# EAGLE board Spartan6dev (EAGLE 5.06), part 1 of 2
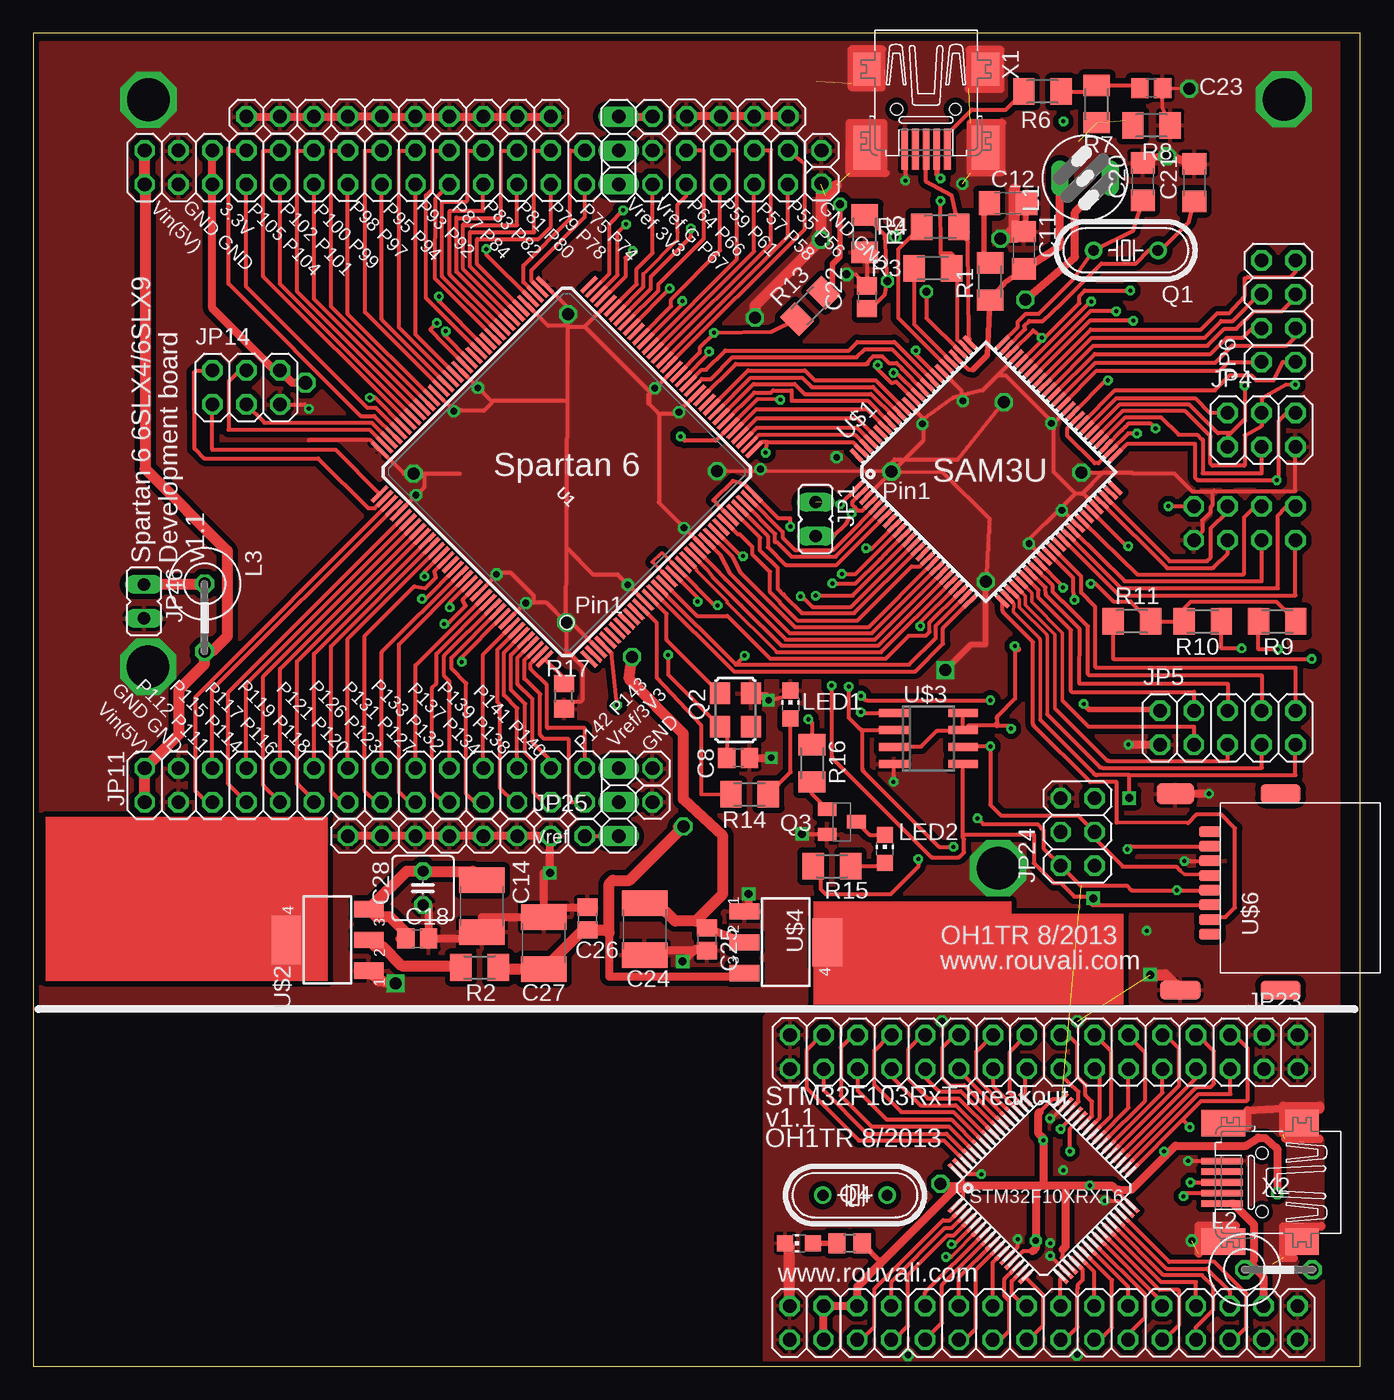
[diagram p3: board, top side]
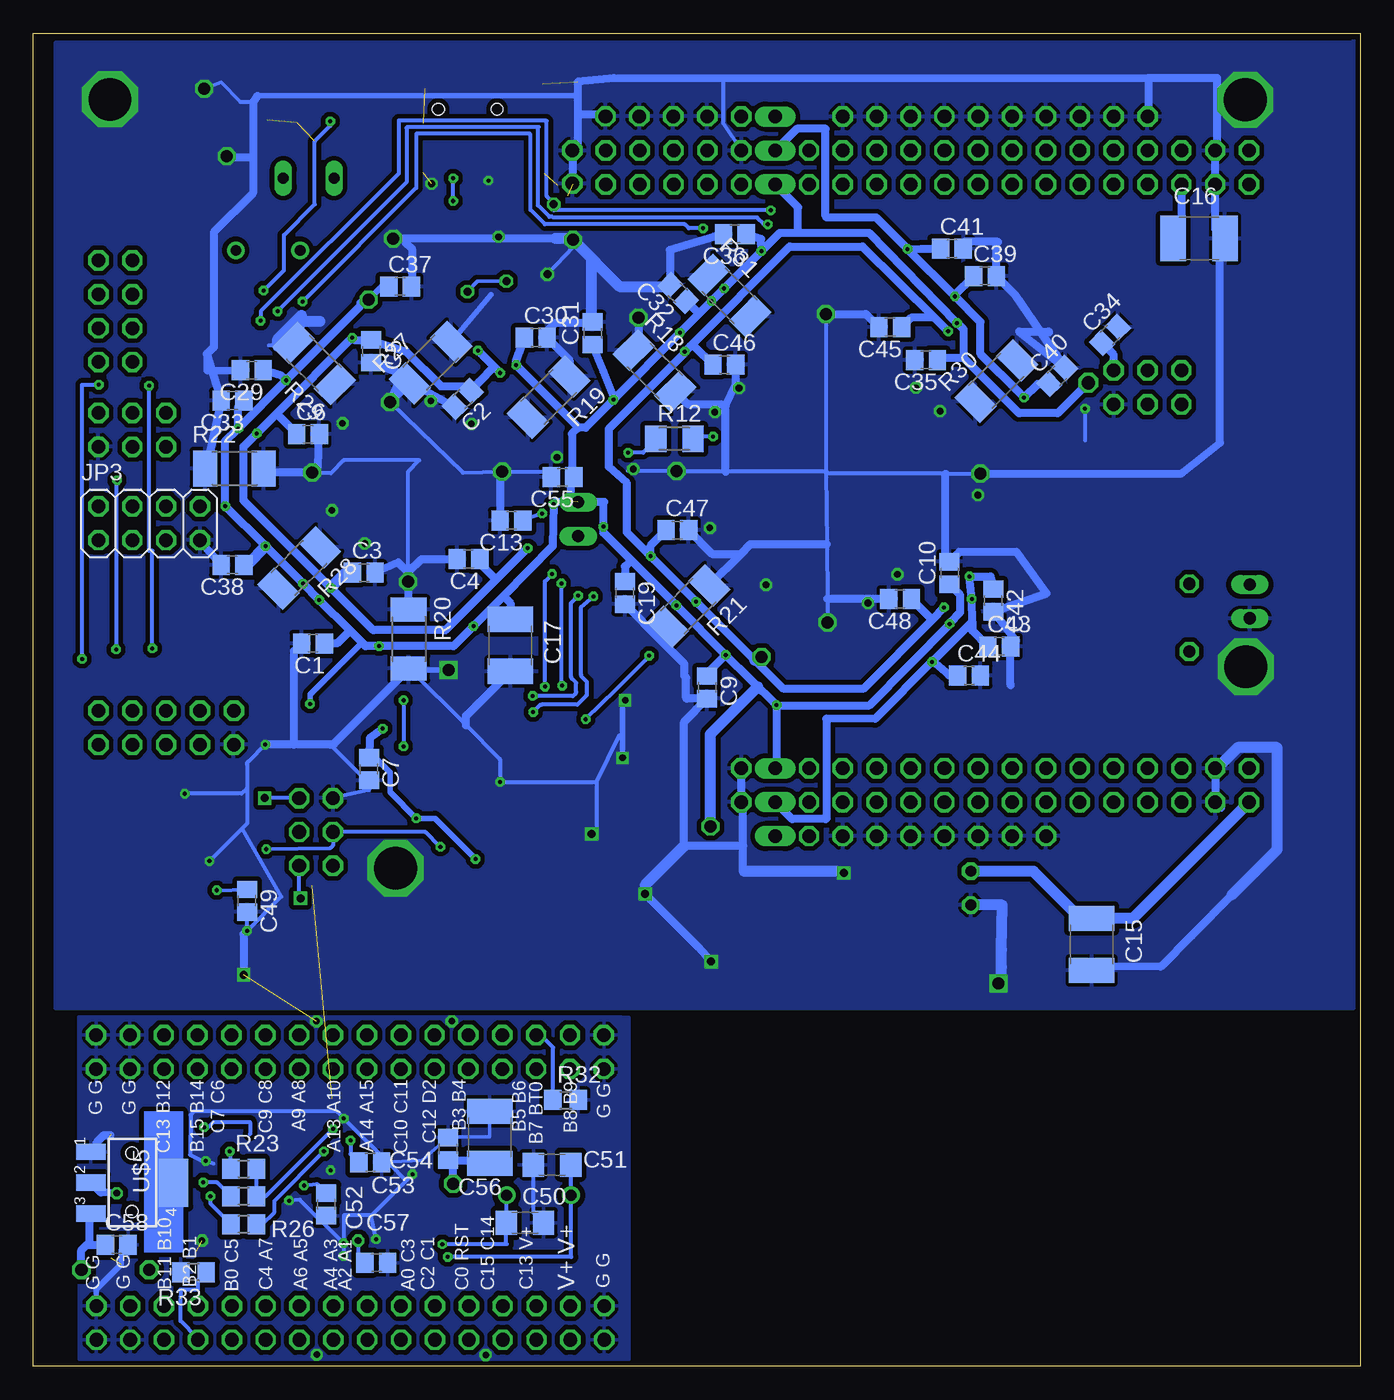
[diagram p4: board, bottom side, seen from below]

Size 99.57 x 100 mm. Coordinates in mm from the lower left corner, seen from the top.
Outline: 0,0 99.57,0 99.57,100 0,100 0,0
Copper layers (1*16): Top 0.035mm / dielectric 1.5mm / Bottom 0.035mm
Design rules "ITEADstudio_DRC *": minimum track width 6mil, minimum drill 12mil, track to track 6mil, track to pad 6mil, pad to pad 6mil, via to via 6mil, smd to smd 0mil, copper to edge 10mil, drill to drill 10mil, minimum pad ring 10mil, minimum via ring 8mil, stop-mask expansion 2mil, vias tented up to drill 100mil, thermal gap 10mil

## Footprints (pad centres in the part's own frame; a part is rotated, then mirrored left to right if it is on the bottom)
C0805 = smd 1.3 x 1.5: 1 -0.85,0; 2 0.85,0
C1206 = smd 1.6 x 1.8: 1 -1.4,0; 2 1.4,0
C1812 = smd 1.9 x 3.4: 1 -1.95,0; 2 1.95,0
C025-050X050 = drill 0.813 octagon: 1 -1.27,0; 2 1.27,0
JP1 = drill 0.914 long: 1 0,-1.27; 2 0,1.27
2X12 = drill 1.016 octagon: 1 -13.97,-1.27; 2 -13.97,1.27; 3 -11.43,-1.27; 4 -11.43,1.27; 5 -8.89,-1.27; 6 -8.89,1.27; 7 -6.35,-1.27; 8 -6.35,1.27; 9 -3.81,-1.27; 10 -3.81,1.27; 11 -1.27,-1.27; 12 -1.27,1.27; 13 1.27,-1.27; 14 1.27,1.27; 15 3.81,-1.27; 16 3.81,1.27; 17 6.35,-1.27; 18 6.35,1.27; 19 8.89,-1.27; 20 8.89,1.27; 21 11.43,-1.27; 22 11.43,1.27; 23 13.97,-1.27; 24 13.97,1.27
2X04 = drill 1.016 octagon: 1 -3.81,-1.27; 2 -3.81,1.27; 3 -1.27,-1.27; 4 -1.27,1.27; 5 1.27,-1.27; 6 1.27,1.27; 7 3.81,-1.27; 8 3.81,1.27
2X03 = drill 1.016 octagon: 1 -2.54,-1.27; 2 -2.54,1.27; 3 0,-1.27; 4 0,1.27; 5 2.54,-1.27; 6 2.54,1.27
2X05 = drill 1.016 octagon: 1 -5.08,-1.27; 2 -5.08,1.27; 3 -2.54,-1.27; 4 -2.54,1.27; 5 0,-1.27; 6 0,1.27; 7 2.54,-1.27; 8 2.54,1.27; 9 5.08,-1.27; 10 5.08,1.27
1X03 = drill 1.016 long: 1 -2.54,0; 2 0,0; 3 2.54,0
1X01 = drill 1.016 octagon: 1 0,0
2X14 = drill 1.016 octagon: 1 -16.51,-1.27; 2 -16.51,1.27; 3 -13.97,-1.27; 4 -13.97,1.27; 5 -11.43,-1.27; 6 -11.43,1.27; 7 -8.89,-1.27; 8 -8.89,1.27; 9 -6.35,-1.27; 10 -6.35,1.27; 11 -3.81,-1.27; 12 -3.81,1.27; 13 -1.27,-1.27; 14 -1.27,1.27; 15 1.27,-1.27; 16 1.27,1.27; 17 3.81,-1.27; 18 3.81,1.27; 19 6.35,-1.27; 20 6.35,1.27; 21 8.89,-1.27; 22 8.89,1.27; 23 11.43,-1.27; 24 11.43,1.27; 25 13.97,-1.27; 26 13.97,1.27; 27 16.51,-1.27; 28 16.51,1.27
2X02 = drill 1.016 octagon: 1 -1.27,-1.27; 2 -1.27,1.27; 3 1.27,-1.27; 4 1.27,1.27
82114R = drill 0.813 long: 1 0,1.905; 2 0,-1.905
LBC-SE = drill 0.914 octagon: 1 -2.54,0; 2 2.54,0
CHIP-LED0805 = smd 1.2 x 1.2: A 0,-1.05; C 0,1.05
HC49/S = drill 0.813 round: 1 -2.413,0; 2 2.413,0
ASF = smd 1.6 x 1.5: 1 -1.25,-1.15; 2 1.25,-1.15; 3 1.25,1.15; 4 -1.25,1.15
SOT23-BEC = smd 1 x 1.4: B -0.95,-1.1; C 0,1.1; E 0.95,-1.1
M1206 = smd 1.6 x 2: 1 -1.4,0; 2 1.4,0
R0805 = smd 1.3 x 1.5: 1 -0.95,0; 2 0.95,0
R5025 = smd 1.8 x 2.7: 1 -2.2,0; 2 2.2,0
TQ144 = smd 1.6 x 0.3: 1 -11.1,8.75; 2 -11.1,8.25; 3 -11.1,7.75; 4 -11.1,7.25; 5 -11.1,6.75; 6 -11.1,6.25; 7 -11.1,5.75; 8 -11.1,5.25; 9 -11.1,4.75; 10 -11.1,4.25; 11 -11.1,3.75; 12 -11.1,3.25; 13 -11.1,2.75; 14 -11.1,2.25; 15 -11.1,1.75; 16 -11.1,1.25; 17 -11.1,0.75; 18 -11.1,0.25; 19 -11.1,-0.25; 20 -11.1,-0.75; 21 -11.1,-1.25; 22 -11.1,-1.75; 23 -11.1,-2.25; 24 -11.1,-2.75; 25 -11.1,-3.25; 26 -11.1,-3.75; 27 -11.1,-4.25; 28 -11.1,-4.75; 29 -11.1,-5.25; 30 -11.1,-5.75; 31 -11.1,-6.25; 32 -11.1,-6.75; 33 -11.1,-7.25; 34 -11.1,-7.75; 35 -11.1,-8.25; 36 -11.1,-8.75; 73 11.1,-8.75; 74 11.1,-8.25; 75 11.1,-7.75; 76 11.1,-7.25; 77 11.1,-6.75; 78 11.1,-6.25; 79 11.1,-5.75; 80 11.1,-5.25; 81 11.1,-4.75; 82 11.1,-4.25; 83 11.1,-3.75; 84 11.1,-3.25; 85 11.1,-2.75; 86 11.1,-2.25; 87 11.1,-1.75; 88 11.1,-1.25; 89 11.1,-0.75; 90 11.1,-0.25; 91 11.1,0.25; 92 11.1,0.75; 93 11.1,1.25; 94 11.1,1.75; 95 11.1,2.25; 96 11.1,2.75; 97 11.1,3.25; 98 11.1,3.75; 99 11.1,4.25; 100 11.1,4.75; 101 11.1,5.25; 102 11.1,5.75; 103 11.1,6.25; 104 11.1,6.75; 105 11.1,7.25; 106 11.1,7.75; 107 11.1,8.25; 108 11.1,8.75 | smd 0.3 x 1.6: 37 -8.75,-11.1; 38 -8.25,-11.1; 39 -7.75,-11.1; 40 -7.25,-11.1; 41 -6.75,-11.1; 42 -6.25,-11.1; 43 -5.75,-11.1; 44 -5.25,-11.1; 45 -4.75,-11.1; 46 -4.25,-11.1; 47 -3.75,-11.1; 48 -3.25,-11.1; 49 -2.75,-11.1; 50 -2.25,-11.1; 51 -1.75,-11.1; 52 -1.25,-11.1; 53 -0.75,-11.1; 54 -0.25,-11.1; 55 0.25,-11.1; 56 0.75,-11.1; 57 1.25,-11.1; 58 1.75,-11.1; 59 2.25,-11.1; 60 2.75,-11.1; 61 3.25,-11.1; 62 3.75,-11.1; 63 4.25,-11.1; 64 4.75,-11.1; 65 5.25,-11.1; 66 5.75,-11.1; 67 6.25,-11.1; 68 6.75,-11.1; 69 7.25,-11.1; 70 7.75,-11.1; 71 8.25,-11.1; 72 8.75,-11.1; 109 8.75,11.1; 110 8.25,11.1; 111 7.75,11.1; 112 7.25,11.1; 113 6.75,11.1; 114 6.25,11.1; 115 5.75,11.1; 116 5.25,11.1; 117 4.75,11.1; 118 4.25,11.1; 119 3.75,11.1; 120 3.25,11.1; 121 2.75,11.1; 122 2.25,11.1; 123 1.75,11.1; 124 1.25,11.1; 125 0.75,11.1; 126 0.25,11.1; 127 -0.25,11.1; 128 -0.75,11.1; 129 -1.25,11.1; 130 -1.75,11.1; 131 -2.25,11.1; 132 -2.75,11.1; 133 -3.25,11.1; 134 -3.75,11.1; 135 -4.25,11.1; 136 -4.75,11.1; 137 -5.25,11.1; 138 -5.75,11.1; 139 -6.25,11.1; 140 -6.75,11.1; 141 -7.25,11.1; 142 -7.75,11.1; 143 -8.25,11.1; 144 -8.75,11.1
TQFP64 = smd 1.2 x 0.3: 1 -5.7,3.75; 2 -5.7,3.25; 3 -5.7,2.75; 4 -5.7,2.25; 5 -5.7,1.75; 6 -5.7,1.25; 7 -5.7,0.75; 8 -5.7,0.25; 9 -5.7,-0.25; 10 -5.7,-0.75; 11 -5.7,-1.25; 12 -5.7,-1.75; 13 -5.7,-2.25; 14 -5.7,-2.75; 15 -5.7,-3.25; 16 -5.7,-3.75; 33 5.7,-3.75; 34 5.7,-3.25; 35 5.7,-2.75; 36 5.7,-2.25; 37 5.7,-1.75; 38 5.7,-1.25; 39 5.7,-0.75; 40 5.7,-0.25; 41 5.7,0.25; 42 5.7,0.75; 43 5.7,1.25; 44 5.7,1.75; 45 5.7,2.25; 46 5.7,2.75; 47 5.7,3.25; 48 5.7,3.75 | smd 0.3 x 1.2: 17 -3.75,-5.7; 18 -3.25,-5.7; 19 -2.75,-5.7; 20 -2.25,-5.7; 21 -1.75,-5.7; 22 -1.25,-5.7; 23 -0.75,-5.7; 24 -0.25,-5.7; 25 0.25,-5.7; 26 0.75,-5.7; 27 1.25,-5.7; 28 1.75,-5.7; 29 2.25,-5.7; 30 2.75,-5.7; 31 3.25,-5.7; 32 3.75,-5.7; 49 3.75,5.7; 50 3.25,5.7; 51 2.75,5.7; 52 2.25,5.7; 53 1.75,5.7; 54 1.25,5.7; 55 0.75,5.7; 56 0.25,5.7; 57 -0.25,5.7; 58 -0.75,5.7; 59 -1.25,5.7; 60 -1.75,5.7; 61 -2.25,5.7; 62 -2.75,5.7; 63 -3.25,5.7; 64 -3.75,5.7
LQFP100 = smd 1.2 x 0.32: 1 -7.75,4.73; 2 -7.75,4.23; 3 -7.75,3.73; 4 -7.75,3.23; 5 -7.75,2.73; 6 -7.75,2.23; 7 -7.75,1.73; 8 -7.75,1.23; 9 -7.75,0.73; 10 -7.75,0.23; 11 -7.75,-0.27; 12 -7.75,-0.77; 13 -7.75,-1.27; 14 -7.75,-1.77; 15 -7.75,-2.27; 16 -7.75,-2.77; 17 -7.75,-3.27; 18 -7.75,-3.77; 19 -7.75,-4.27; 20 -7.75,-4.77; 21 -7.75,-5.27; 22 -7.75,-5.77; 23 -7.75,-6.27; 24 -7.75,-6.77; 25 -7.75,-7.27; 51 7.75,-7.27; 52 7.75,-6.77; 53 7.75,-6.27; 54 7.75,-5.77; 55 7.75,-5.27; 56 7.75,-4.77; 57 7.75,-4.27; 58 7.75,-3.77; 59 7.75,-3.27; 60 7.75,-2.77; 61 7.75,-2.27; 62 7.75,-1.77; 63 7.75,-1.27; 64 7.75,-0.77; 65 7.75,-0.27; 66 7.75,0.23; 67 7.75,0.73; 68 7.75,1.23; 69 7.75,1.73; 70 7.75,2.23; 71 7.75,2.73; 72 7.75,3.23; 73 7.75,3.73; 74 7.75,4.23; 75 7.75,4.73 | smd 0.32 x 1.2: 26 -6,-9.02; 27 -5.5,-9.02; 28 -5,-9.02; 29 -4.5,-9.02; 30 -4,-9.02; 31 -3.5,-9.02; 32 -3,-9.02; 33 -2.5,-9.02; 34 -2,-9.02; 35 -1.5,-9.02; 36 -1,-9.02; 37 -0.5,-9.02; 38 0,-9.02; 39 0.5,-9.02; 40 1,-9.02; 41 1.5,-9.02; 42 2,-9.02; 43 2.5,-9.02; 44 3,-9.02; 45 3.5,-9.02; 46 4,-9.02; 47 4.5,-9.02; 48 5,-9.02; 49 5.5,-9.02; 50 6,-9.02; 76 6,6.48; 77 5.5,6.48; 78 5,6.48; 79 4.5,6.48; 80 4,6.48; 81 3.5,6.48; 82 3,6.48; 83 2.5,6.48; 84 2,6.48; 85 1.5,6.48; 86 1,6.48; 87 0.5,6.48; 88 0,6.48; 89 -0.5,6.48; 90 -1,6.48; 91 -1.5,6.48; 92 -2,6.48; 93 -2.5,6.48; 94 -3,6.48; 95 -3.5,6.48; 96 -4,6.48; 97 -4.5,6.48; 98 -5,6.48; 99 -5.5,6.48; 100 -6,6.48
SOT223 = smd 1.219 x 2.235: 1 -2.311,-3.099; 2 0,-3.099; 3 2.311,-3.099 | smd 3.6 x 2.2: 4 0,3.099
SOIC8 = smd 0.6 x 2.2: 1 -1.905,-2.6; 2 -0.635,-2.6; 3 0.635,-2.6; 4 1.905,-2.6; 5 1.905,2.6; 6 0.635,2.6; 7 -0.635,2.6; 8 -1.905,2.6
MICROSDPAK = smd 0.8 x 1.6: 1 -2.03,9.47; 2 -0.93,9.47; 3 0.17,9.47; 4 1.27,9.47; 5 2.37,9.47; 6 3.47,9.47; 7 4.57,9.47; 8 5.67,9.47 | smd 1.55 x 2.8: 9 8.497,12.05 | smd 1.4 x 3: 10 -6.22,11.68; 11 -6.22,4.162; 12 8.512,4.162
32005-201 = smd 3.1 x 0.5: 1 3,1.6; 2 3,0.8; 3 3,0; 4 3,-0.8; 5 3,-1.6 | smd 2.5 x 2: M1 -3,-4.45; M2 -3,4.45 | smd 3.3 x 2: M3 2.9,4.45; M4 2.9,-4.45 | hole 0.9: 0,2.2; 0,-2.2

## Placement (x,y rotation side)
C1  [C0805]  78.59,54.23 180 bottom
C2  [C0805]  67.36,72.57 225 bottom
C3  [C0805]  74.78,59.54 0 bottom
C4  [C0805]  66.93,60.55 180 bottom
C5  [C0805]  74.22,76.15 270 bottom
C6  [C0805]  78.97,69.93 0 bottom
C7  [C0805]  74.4,44.81 270 bottom
C8  [C0805]  52.88,45.64 0 top
C9  [C0805]  49.02,50.93 270 bottom
C10  [C0805]  30.84,59.51 90 bottom
C11  [C1206]  74.32,83.72 90 top
C12  [C1206]  73.13,87.27 0 top
C13  [C0805]  63.7,63.45 180 bottom
C14  [C1812]  33.66,34.52 270 top
C15  [C1812]  20.17,31.65 270 bottom
C16  [C1812]  12.12,84.61 0 bottom
C17  [C1812]  63.78,54.08 270 bottom
C18  [C0805]  28.8,32.08 0 top
C19  [C0805]  55.19,58.01 270 bottom
C20  [C1206]  83.24,88.87 90 top
C21  [C1206]  87.1,88.8 90 top
C22  [C0805]  62.56,80.19 90 top
C23  [C0805]  83.87,95.89 0 top
C24  [C1812]  45.87,32.79 270 top
C25  [C0805]  50.55,32.03 270 top
C26  [C0805]  41.58,33.58 90 top
C27  [C1812]  38.3,31.75 90 top
C28  [C025-050X050]  29.24,35.86 270 top
C29  [C0805]  83.19,74.73 180 bottom
C30  [C0805]  61.87,77.17 0 bottom
C31  [C0805]  57.61,77.5 90 bottom
C32  [C0805]  51.21,80.52 135 bottom
C33  [C0805]  84.63,72.44 180 bottom
C34  [C0805]  18.8,77.37 45 bottom
C35  [C0805]  32.59,75.49 180 bottom
C36  [C0805]  46.94,84.94 180 bottom
C37  [C0805]  72.06,81 0 bottom
C38  [C0805]  84.63,60.12 180 bottom
C39  [C0805]  28.17,81.79 0 bottom
C40  [C0805]  22.76,74.3 45 bottom
C41  [C0805]  30.66,83.85 0 bottom
C42  [C0805]  27.56,57.45 270 bottom
C43  [C0805]  27.1,54 0 bottom
C44  [C0805]  29.36,51.82 0 bottom
C45  [C0805]  35.28,77.95 180 bottom
C46  [C0805]  47.73,75.13 0 bottom
C47  [C0805]  51.26,62.71 0 bottom
C48  [C0805]  34.54,57.56 180 bottom
C49  [C0805]  83.54,34.92 270 bottom
C50  [C1206]  62.69,10.77 0 bottom
C51  [C1206]  60.66,15.11 180 bottom
C52  [C0805]  77.6,12.14 270 bottom
C53  [C0805]  74.3,15.29 0 bottom
C54  [C0805]  68.45,16.31 90 bottom
C55  [C0805]  59.87,66.7 180 bottom
C56  [C1812]  65.33,17.17 90 bottom
C57  [C0805]  73.84,7.77 0 bottom
C58  [C0805]  93.32,9.12 0 bottom
JP1  [JP1]  58.7,63.55 180 top
JP2  [2X12]  75.79,3.25 0 top
JP3  [2X04]  90.88,63.25 0 bottom
JP4  [2X03]  92.15,70.26 0 top
JP5  [2X05]  89.61,47.9 0 top
JP6  [2X04]  93.42,79.15 90 top
JP7  [2X05]  51.54,89.94 0 top
JP8  [1X03]  43.92,91.21 90 top
JP9  [1X01]  46.46,93.75 0 top
JP10  [2X14]  24.87,89.94 0 top
JP11  [2X14]  24.87,43.59 0 top
JP12  [1X03]  43.92,42.32 270 top
JP13  [1X01]  41.38,39.78 0 top
JP14  [2X03]  15.98,73.43 0 top
JP15  [1X01]  59.13,91.21 0 top
JP16  [1X01]  59.13,88.72 0 top
JP17  [1X01]  46.46,42.32 0 top
JP18  [1X01]  46.46,44.86 0 top
JP19  [2X12]  75.82,23.57 0 top
JP20  [2X02]  58.04,23.57 180 top
JP21  [2X02]  58.01,3.25 0 top
JP22  [2X02]  93.57,3.25 0 top
JP23  [2X02]  93.6,23.57 0 top
JP24  [2X03]  78.36,40.08 90 top
JP25  [1X01]  38.84,39.78 0 top
JP26  [1X01]  31.22,39.78 0 top
JP27  [1X01]  26.14,39.78 0 top
JP28  [1X01]  36.3,39.78 0 top
JP29  [1X01]  33.76,39.78 0 top
JP30  [1X01]  28.68,39.78 0 top
JP31  [1X01]  23.6,39.78 0 top
JP32  [1X01]  56.64,93.78 0 top
JP33  [1X01]  54.1,93.78 0 top
JP34  [1X01]  51.56,93.78 0 top
JP35  [1X01]  49.02,93.78 0 top
JP36  [1X01]  38.84,93.75 0 top
JP37  [1X01]  36.3,93.75 0 top
JP38  [1X01]  33.76,93.75 0 top
JP39  [1X01]  31.22,93.75 0 top
JP40  [1X01]  28.68,93.75 0 top
JP41  [1X01]  26.14,93.75 0 top
JP42  [1X01]  23.6,93.78 0 top
JP43  [1X01]  21.06,93.75 0 top
JP44  [1X01]  18.52,93.75 0 top
JP45  [1X01]  15.98,93.75 0 top
JP46  [JP1]  8.31,57.38 180 top
L1  82114R  [82114R]  78.92,89.13 90 top
L2  LBC-SE  [LBC-SE]  93.42,7.24 0 top
L3  LBC-SE  [LBC-SE]  12.85,56.16 270 top
LED1  [CHIP-LED0805]  56.82,49.66 0 top
LED2  [CHIP-LED0805]  63.88,38.81 0 top
LED3  [CHIP-LED0805]  57.45,9.22 90 top
Q1  [HC49/S]  81.97,83.72 180 top
Q2  ASF1  [ASF]  52.68,49.23 90 top
Q3  BC817-16LT1SMD  [SOT23-BEC]  60.66,40.84 270 top
Q4  [HC49/S]  61.65,12.83 0 top
R1  [M1206]  71.78,81.38 270 top
R2  [M1206]  33.48,29.92 180 top
R3  [M1206]  67.49,82.37 0 top
R4  [M1206]  68.05,85.47 0 top
R5  [M1206]  62.38,84.96 270 top
R6  [M1206]  75.72,95.63 0 top
R7  [M1206]  79.78,94.69 270 top
R8  [M1206]  83.9,93.09 0 top
R9  [M1206]  93.32,55.88 180 top
R10  [M1206]  87.73,55.88 180 top
R11  [M1206]  82.42,55.88 0 top
R12  4.7k  [M1206]  51.49,69.57 0 bottom
R13  330  [M1206]  58.29,79.55 225 top
R14  160  [M1206]  53.75,42.9 180 top
R15  160  [M1206]  59.92,37.52 180 top
R16  160  [M1206]  58.42,45.24 90 top
R17  [R0805]  39.8,50.27 90 top
R18  [R5025]  52.96,74.68 315 bottom
R19  [R5025]  60.91,72.72 225 bottom
R20  [R5025]  71.4,54.56 270 bottom
R21  [R5025]  50.42,57.02 225 bottom
R22  [R5025]  84.48,67.36 0 bottom
R23  [R0805]  83.79,14.81 0 bottom
R24  [R0805]  61.24,9.22 180 top
R25  [R0805]  83.79,12.75 180 bottom
R26  [R0805]  83.79,10.64 180 bottom
R27  [R5025]  69.77,75.29 45 bottom
R28  [R5025]  79.63,59.89 225 bottom
R29  [R5025]  78.51,75.23 135 bottom
R30  [R5025]  27.33,73.91 45 bottom
R31  [R5025]  47.35,80.31 315 bottom
R32  [R0805]  59.64,19.96 0 bottom
R33  [R0805]  87.55,7.06 180 bottom
U1  6SLX9TQG144  [TQ144]  40.03,67.11 135 top
U2  STM32F10XRXT6  [TQFP64]  75.79,13.36 45 top
U$1  SAM3U  [LQFP100]  70.59,68 45 top
U$2  LD1117  [SOT223]  22.07,31.98 90 top
U$3  W25Q80BV  [SOIC8]  67.16,47.09 270 top
U$4  LD1117  [SOT223]  56.46,31.8 270 top
U$5  LD1117  [SOT223]  92.15,13.77 270 bottom
U$6  MICROSDCONNECTOR  [MICROSDPAK]  97.74,34.44 90 top
X1  MINI-USB-32005-201  [32005-201]  66.98,94.31 270 top
X2  MINI-USB-32005-201  [32005-201]  92.18,13.79 180 top